# Altium project Aut_Sys_M_T_Acc_Eyes.PrjPCB
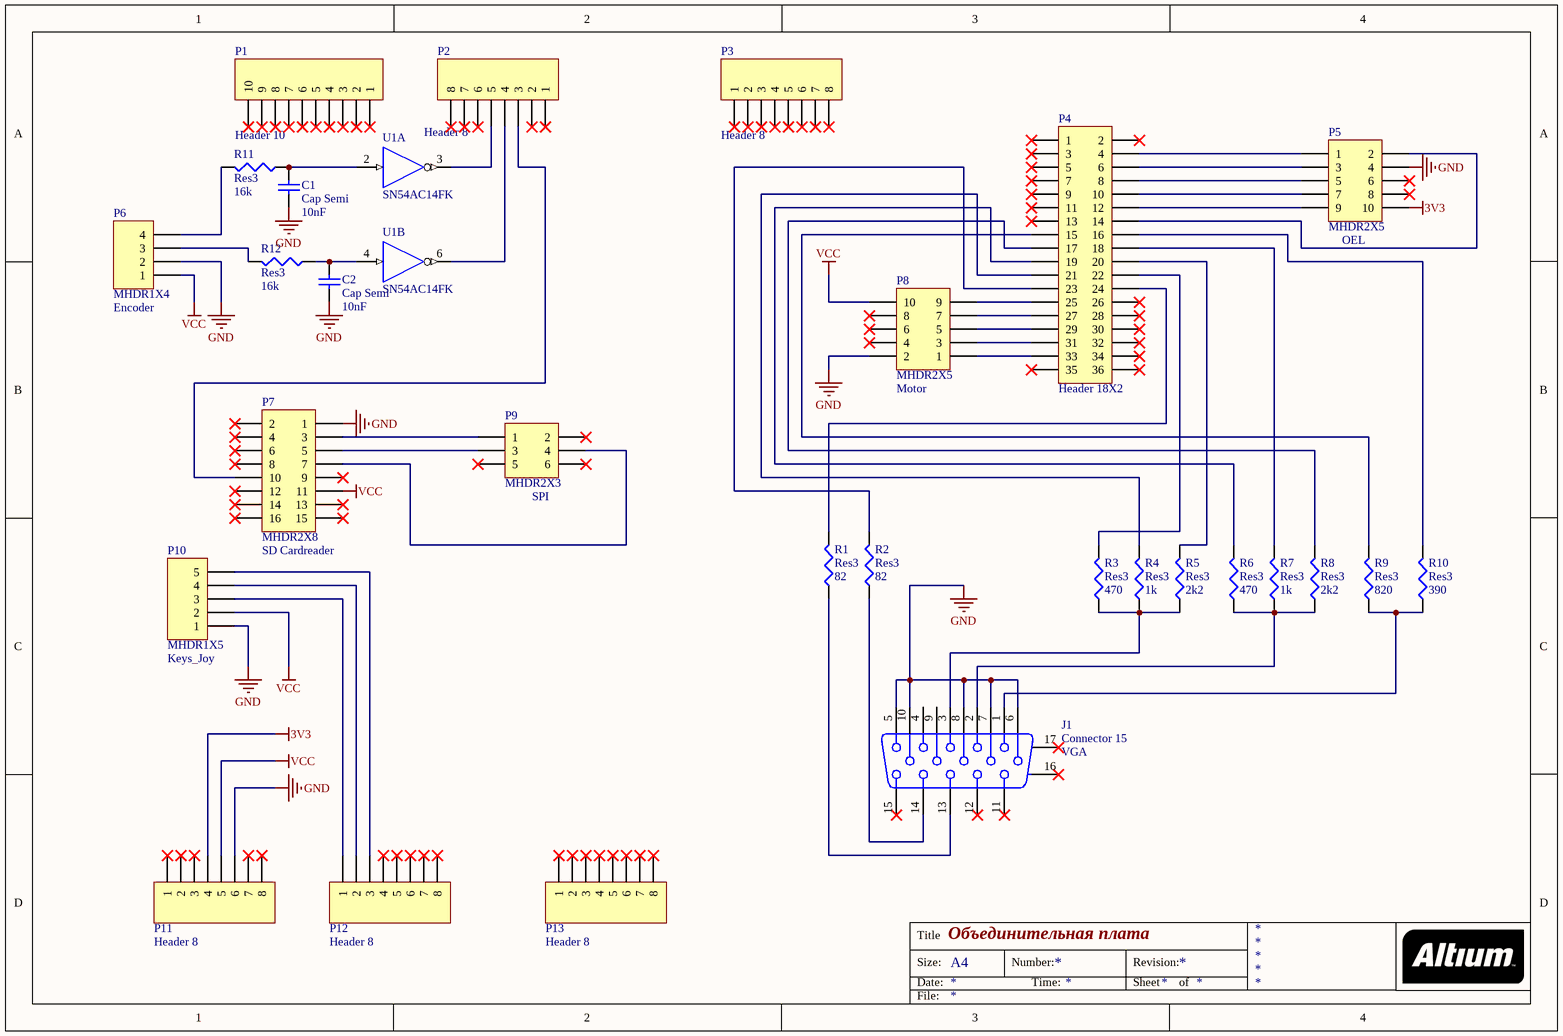
[diagram p0: unifying.SchDoc]
1 sheet, 29 parts. Net scope: global (net labels, ports and power ports of the same name join across sheets).

## Sheet unifying.SchDoc: Объединительная плата
size A4; Author: Кузнецов Д. П.; Scale: {Масш.}; Title1str: {Наименование}; PageSetup: Record=PageOptions|CenterHorizontal=False|CenterVertical=False|PrintScale=0.95|XCorrection=0.00|YCorrection=0.00|PrintKind=1|BorderSize=5000000|LeftOffset=0|BottomOffset=0|Orientation=1|PaperLength=1000|PaperWidth=1000|Scale=100|PaperSource=15|PrintQuality=600|MediaType=1|DitherType=10|PaperKind=A4|PrintScaleMode=1; Title2str: {Наименование}; ProcessInspection: {Т.контр.}; Mass: {Масса}; NormInspection: {Н.контр.}; EngineerName: {Инженер}; Letter1Column: {}; Letter2Column: {}; Letter3Column: {}; DocumentType: {Документ}; DocumentType1str: {Документ}; DocumentType2str: {Документ}

### Parts
C1  Cap Semi  value 10nF  [C1206]
C2  Cap Semi  value 10nF  [C1206]
J1  Connector 15  [050DSUB0.762-4H15]
P1  Header 10  [HDR1X10]
P2  Header 8  [HDR1X8]
P3  Header 8  [HDR1X8]
P4  Header 18X2  [HDR2X18]
P5  MHDR2X5  [MHDR2X5]
P6  MHDR1X4  [MHDR1X4]
P7  MHDR2X8  [MHDR2X8]
P8  MHDR2X5  [MHDR2X5]
P9  MHDR2X3  [MHDR2X3]
P10  MHDR1X5  [MHDR1X5]
P11  Header 8  [HDR1X8]
P12  Header 8  [HDR1X8]
P13  Header 8  [HDR1X8]
R1  Res3  value 82  [J1-0603]
R2  Res3  value 82  [J1-0603]
R3  Res3  value 470  [J1-0603]
R4  Res3  value 1k  [J1-0603]
R5  Res3  value 2k2  [J1-0603]
R6  Res3  value 470  [J1-0603]
R7  Res3  value 1k  [J1-0603]
R8  Res3  value 2k2  [J1-0603]
R9  Res3  value 820  [J1-0603]
R10  Res3  value 390  [J1-0603]
R11  Res3  value 16k  [J1-0603]
R12  Res3  value 16k  [J1-0603]
U1  SN54AC14FK  [FK020]  (parts A,B of 6)

### Nets
3V3: P5.10 P11.4
GND: C1.1 C2.1 J1.5 J1.6 J1.7 J1.8 J1.10 P5.4 P6.2 P7.1 P8.2 P10.1 P11.6 U1.10(GND)
VCC: P6.1 P7.11 P8.10 P10.2 P11.5 U1.20(VCC)
NetC1_2: C1.2 R11.1 U1.2(A)
NetC2_2: C2.2 R12.1 U1.4(A)
NetJ1_1: J1.1 R9.1 R10.1
NetJ1_2: J1.2 R6.1 R7.1 R8.1
NetJ1_3: J1.3 R3.1 R4.1 R5.1
NetJ1_13: J1.13 R1.1
NetJ1_14: J1.14 R2.1
NetP2_3: P2.3 P7.10
NetP2_4: P2.4 U1.6(Y)
NetP2_5: P2.5 U1.3(Y)
NetP4_4: P4.4 P5.1
NetP4_6: P4.6 P5.3
NetP4_8: P4.8 P5.5
NetP4_10: P4.10 P5.7
NetP4_12: P4.12 P5.9
NetP4_14: P4.14 P5.2
NetP4_15: P4.15 R9.2
NetP4_16: P4.16 R10.2
NetP4_17: P4.17 R8.2
NetP4_18: P4.18 R7.2
NetP4_19: P4.19 R6.2
NetP4_20: P4.20 R5.2
NetP4_21: P4.21 R4.2
NetP4_22: P4.22 R3.2
NetP4_23: P4.23 R2.2
NetP4_24: P4.24 R1.2
NetP4_25: P4.25 P8.9
NetP4_27: P4.27 P8.7
NetP4_29: P4.29 P8.5
NetP4_31: P4.31 P8.3
NetP4_33: P4.33 P8.1
NetP6_3: P6.3 R12.2
NetP6_4: P6.4 R11.2
NetP7_3: P7.3 P9.1
NetP7_5: P7.5 P9.3
NetP7_7: P7.7 P9.4
NetP10_3: P10.3 P12.1
NetP10_4: P10.4 P12.2
NetP10_5: P10.5 P12.3

Not connected (* = marked no-connect by the designer): J1 4 9 11* 12* 15* 16(MH1)* 17(MH2)*; P1 1* 2* 3* 4* 5* 6* 7* 8* 9* 10*; P2 1* 2* 6* 7* 8*; P3 1* 2* 3* 4* 5* 6* 7* 8*; P4 1* 2* 3* 5* 7* 9* 11* 13* 26* 28* 30* 32* 34* 35* 36*; P5 6* 8*; P7 2* 4* 6* 8* 9* 12* 13* 14* 15* 16*; P8 4* 6* 8*; P9 2* 5* 6*; P11 1* 2* 3* 7* 8*; P12 4* 5* 6* 7* 8*; P13 1* 2* 3* 4* 5* 6* 7* 8*

### Notes on the sheet
- Title
- Size:
- Date:
- A4
- Number:
- Time:
- Revision:
- Sheet
- of
- File:
- (in symbol Connector 15) VGA
- (in symbol MHDR1X4) Encoder
- (in symbol MHDR1X5) Keys_Joy
- (in symbol MHDR2X3) SPI
- (in symbol MHDR2X5) Motor; OEL
- (in symbol MHDR2X8) SD Cardreader

### Library data of the parts
C1 C2 = Cap Semi: Capacitor (Semiconductor SIM Model); Published: 8-Jun-2000; LatestRevisionDate: 29-May-2009; LatestRevisionNote: IPC-7351 Footprint Added.; PackageReference: C1206; Publisher: Altium Limited; PackageDescription: Chip Capacitor
J1 = Connector 15: Receptacle Assembly, 15-Pin, Sim Line Connector; PackageDocument: B; Positions: 15; Gender: Receptacle Header; Published: 15-Jun-2001; LatestRevisionDate: 17-Jul-2002; LatestRevisionNote: Re-released for DXP Platform.; DatasheetDocument: 24-Nov-1999; PackageReference: 788574; Publisher: Altium Limited; Orientation: Right Angle
P1 = Header 10: Header, 10-Pin; LatestRevisionDate: 17-Jul-2002; LatestRevisionNote: Re-released for DXP Platform.; Publisher: Altium Limited
P2 P3 P11-P13 = Header 8: Header, 8-Pin; LatestRevisionDate: 17-Jul-2002; LatestRevisionNote: Re-released for DXP Platform.; Publisher: Altium Limited
P4 = Header 18X2: Header, 18-Pin, Dual row; LatestRevisionDate: 17-Jul-2002; LatestRevisionNote: Re-released for DXP Platform.; Publisher: Altium Limited
P5 P8 = MHDR2X5: Header, 5-Pin, Dual row; LatestRevisionDate: 17-Jul-2002; LatestRevisionNote: Re-released for DXP Platform.; Publisher: Altium Limited
P6 = MHDR1X4: Header, 4-Pin; LatestRevisionDate: 17-Jul-2002; LatestRevisionNote: Re-released for DXP Platform.; Publisher: Altium Limited
P7 = MHDR2X8: Header, 8-Pin, Dual row; LatestRevisionDate: 17-Jul-2002; LatestRevisionNote: Re-released for DXP Platform.; Publisher: Altium Limited
P9 = MHDR2X3: Header, 3-Pin, Dual row; LatestRevisionDate: 17-Jul-2002; LatestRevisionNote: Re-released for DXP Platform.; Publisher: Altium Limited
P10 = MHDR1X5: Header, 5-Pin; LatestRevisionDate: 17-Jul-2002; LatestRevisionNote: Re-released for DXP Platform.; Publisher: Altium Limited
R1-R12 = Res3: Resistor; Published: 8-Jun-2000; LatestRevisionDate: 29-May-2009; LatestRevisionNote: IPC-7351 Footprint Added.; PackageReference: J1-0603; Publisher: Altium Limited; PackageDescription: Chip Resistor
U1 = SN54AC14FK: Hex Schmitt-Trigger Inverter; Note: Pins 1, 5, 7, 11, 15 and 17 are not connected and not drawn; Published: 8-Jun-2000; LatestRevisionDate: 17-Jul-2002; LatestRevisionNote: Re-released for DXP Platform.; DatasheetVersion: Feb-1998; PackageVersion: 1998; PackageReference: FK020; Publisher: Altium Limited; PackageDescription: Leadless Chip Carrier; 20 Terminals; Body 8.9 x 8.9 mm; ComponentLink1Description: Manufacturer Link; ComponentLink1URL: http://www.ti.com/; ComponentLink2Description: Datasheet; ComponentLink2URL: http://www-s.ti.com/sc/ds/sn54ac14.pdf; ComponentLink3Description: Packaging Specification; ComponentLink3URL: http://www-s.ti.com/sc/psheets/mlcc006b/mlcc006b.pdf